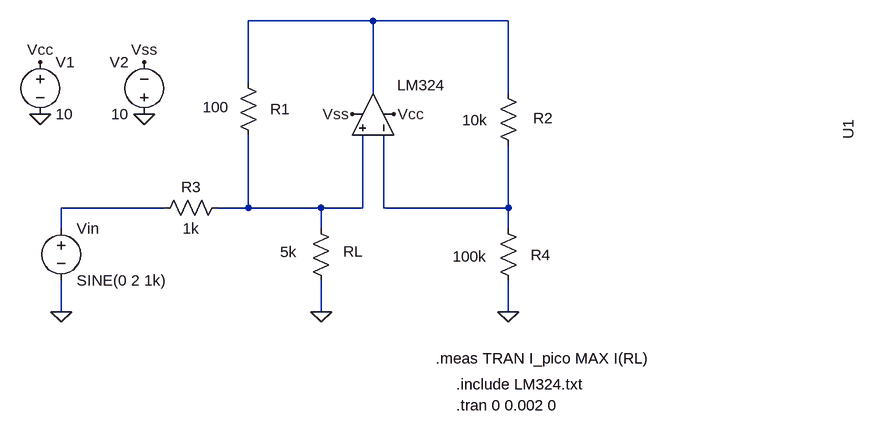
[diagram p0: schematic lab1-2.asc]
lab1-2.asc, the LTspice schematic file:
Version 4.1
SHEET 1 880 924
WIRE 64 -16 -128 -16
WIRE 272 -16 64 -16
WIRE -128 80 -128 -16
WIRE 64 96 64 -16
WIRE 272 96 272 -16
WIRE -256 272 -416 272
WIRE -128 272 -128 160
WIRE -128 272 -176 272
WIRE -16 272 -128 272
WIRE 48 272 48 160
WIRE 48 272 -16 272
WIRE 80 272 80 160
WIRE 272 272 272 176
WIRE 272 272 80 272
WIRE -416 304 -416 272
WIRE -16 304 -16 272
WIRE 272 304 272 272
WIRE -416 432 -416 384
WIRE -16 432 -16 384
WIRE 272 432 272 384
FLAG -16 432 0
FLAG 272 432 0
FLAG -448 128 0
FLAG -288 128 0
FLAG -448 48 Vcc
FLAG -288 48 Vss
FLAG -416 432 0
FLAG 96 128 Vcc
FLAG 32 128 Vss
DATAFLAG 752 832 "-I(Rl)"
DATAFLAG 736 640 "I(R1)"
DATAFLAG 752 880 "I(R3)"
DATAFLAG 736 736 "I(R2)"
DATAFLAG 752 800 "I(R4)"
DATAFLAG 752 688 ""
DATAFLAG 752 768 ""
DATAFLAG 80 416 "I(RL)"
SYMBOL OpAmps\\opamp2 128 128 M270
WINDOW 0 -39 -667 Left 2
WINDOW 3 45 27 VLeft 2
SYMATTR InstName U1
SYMATTR Value LM324
SYMBOL res -144 64 R0
WINDOW 0 50 56 Left 2
WINDOW 3 -54 53 Left 2
SYMATTR InstName R1
SYMATTR Value 100
SYMBOL res 256 80 R0
WINDOW 0 54 54 Left 2
WINDOW 3 -55 57 Left 2
SYMATTR InstName R2
SYMATTR Value 10k
SYMBOL res -160 256 R90
WINDOW 0 0 56 VBottom 2
WINDOW 3 32 56 VTop 2
SYMATTR InstName R3
SYMATTR Value 1k
SYMBOL res 288 400 R180
WINDOW 0 -49 55 Left 2
WINDOW 3 49 53 Left 2
SYMATTR InstName R4
SYMATTR Value 100k
SYMBOL res 0 400 R180
WINDOW 0 -49 61 Left 2
WINDOW 3 53 60 Left 2
SYMATTR InstName RL
SYMATTR Value 5k
SYMBOL voltage -448 32 R0
WINDOW 123 0 0 Left 0
WINDOW 39 0 0 Left 0
SYMATTR InstName V1
SYMATTR Value 10
SYMBOL voltage -288 144 R180
WINDOW 0 24 96 Left 2
WINDOW 3 24 16 Left 2
WINDOW 123 0 0 Left 0
WINDOW 39 0 0 Left 0
SYMATTR InstName V2
SYMATTR Value 10
SYMBOL voltage -416 288 R0
WINDOW 123 0 0 Left 0
WINDOW 39 0 0 Left 0
SYMATTR InstName Vin
SYMATTR Value SINE(0 2 1k)
TEXT 192 544 Left 2 !.include LM324.txt
TEXT 192 576 Left 2 !.tran 0 0.002 0
TEXT 160 504 Left 2 !.meas TRAN I_pico MAX I(RL)

The netlist it stands for:
* lab1-2.asc
X§U1 N003 N004 Vcc Vss N001 LM324  ; pins In+ In- V+ V- OUT
R1 N001 N003 100
R2 N001 N004 10k
R3 N003 N002 1k
R4 0 N004 100k
RL 0 N003 5k
V1 Vcc 0 10
V2 0 Vss 10
Vin N002 0 SINE(0 2 1k)
.include LM324.txt
.tran 0 0.002 0
.meas TRAN I_pico MAX I(RL)
.backanno
.end